# EAGLE schematic zeeSoC_mp3_Shield_v1.0 (EAGLE 6.5.0)

## Sheet 1 of 2
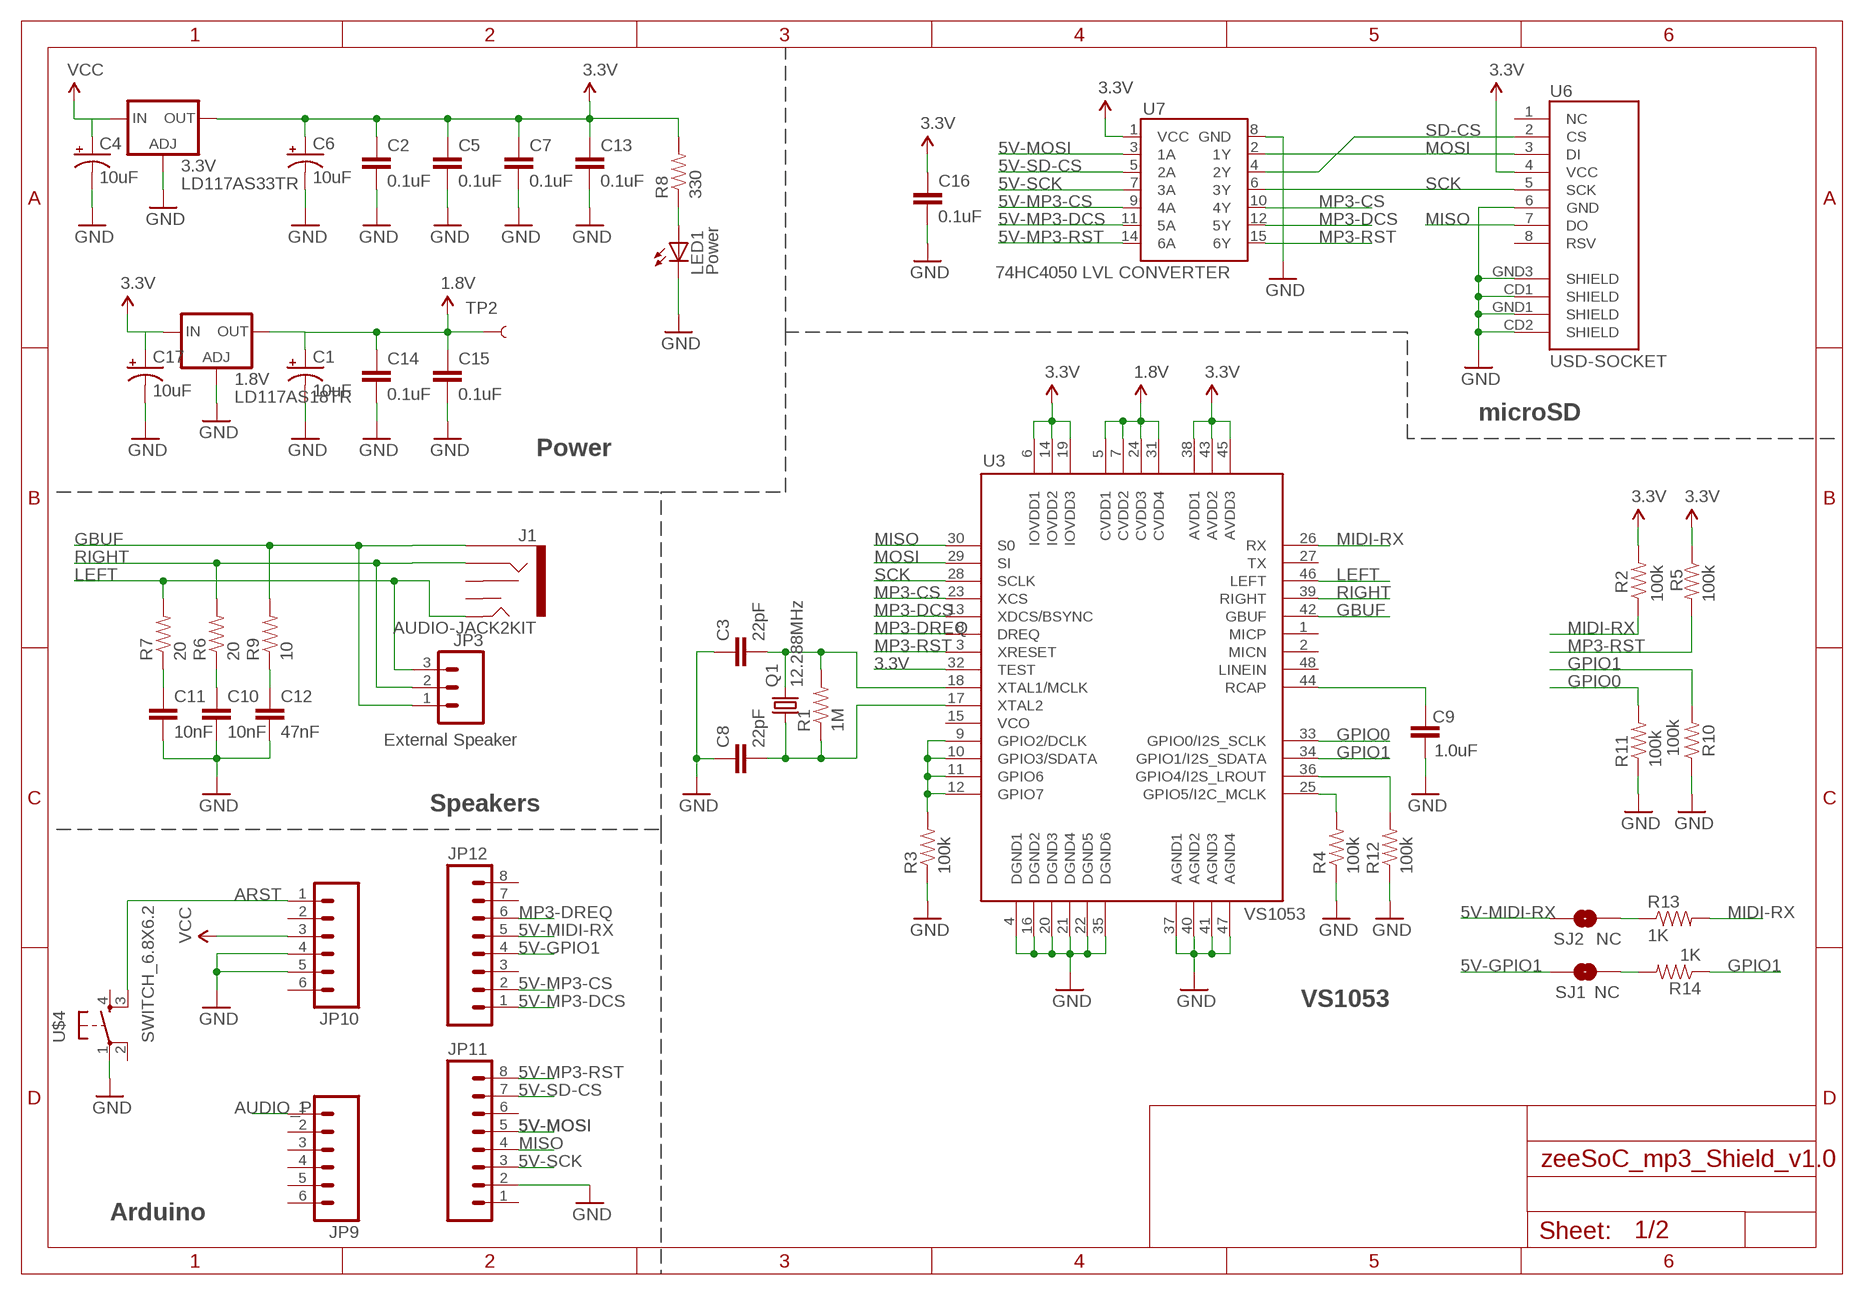
[diagram p0: schematic, sheet 1]

### Parts
1.8V  LD117AS18TR  [SOT223]
3.3V  LD117AS33TR  [SOT223]
C1  10uF  CAP_POL1206  [EIA3216]
C2  0.1uF  CAP0603-CAP  [0603-CAP]
C3  22pF  CAP0603-CAP  [0603-CAP]
C4  10uF  CAP_POL1206  [EIA3216]
C5  0.1uF  CAP0603-CAP  [0603-CAP]
C6  10uF  CAP_POL1206  [EIA3216]
C7  0.1uF  CAP0603-CAP  [0603-CAP]
C8  22pF  CAP0603-CAP  [0603-CAP]
C9  1.0uF  CAP0603-CAP  [0603-CAP]
C10  10nF  CAP0603-CAP  [0603-CAP]
C11  10nF  CAP0603-CAP  [0603-CAP]
C12  47nF  CAP0603-CAP  [0603-CAP]
C13  0.1uF  CAP0603-CAP  [0603-CAP]
C14  0.1uF  CAP0603-CAP  [0603-CAP]
C15  0.1uF  CAP0603-CAP  [0603-CAP]
C16  0.1uF  CAP0603-CAP  [0603-CAP]
C17  10uF  CAP_POL1206  [EIA3216]
J1  AUDIO-JACK2KIT  [AUDIO-JACK-KIT]
JP3  External Speaker  M03PTH  [1X03]
JP9  M06SILK_FEMALE_PTH  [1X06]
JP10  M06SILK_FEMALE_PTH  [1X06]
JP11  M08SILK_FEMALE_PTH  [1X08]
JP12  M08SILK_FEMALE_PTH  [1X08]
LED1  Power  LED0603  [LED-0603]
Q1  12.288MHz  CRYSTALHC49US  [HC49US]
R1  1M  RESISTOR0603-RES  [0603-RES]
R2  100k  RESISTOR0603-RES  [0603-RES]
R3  100k  RESISTOR0603-RES  [0603-RES]
R4  100k  RESISTOR0603-RES  [0603-RES]
R5  100k  RESISTOR0603-RES  [0603-RES]
R6  20  RESISTOR0603-RES  [0603-RES]
R7  20  RESISTOR0603-RES  [0603-RES]
R8  330  RESISTOR0603-RES  [0603-RES]
R9  10  RESISTOR0603-RES  [0603-RES]
R10  100k  RESISTOR0603-RES  [0603-RES]
R11  100k  RESISTOR0603-RES  [0603-RES]
R12  100k  RESISTOR0603-RES  [0603-RES]
R13  1K  RESISTOR0603-RES  [0603-RES]
R14  1K  RESISTOR0603-RES  [0603-RES]
SJ1  NC  JUMPER-PAD-2-NOYES_SILK  [PAD-JUMPER-2-NO_YES_SILK]
SJ2  NC  JUMPER-PAD-2-NOYES_SILK  [PAD-JUMPER-2-NO_YES_SILK]
TP2  TEST-POINT3X5  [PAD.03X.05]
U3  VS1053  VS1033  [LQFP-48]
U6  USD-SOCKET  USD-SOCKETNEW  [MICRO-SD-SOCKET-PP]
U7  74HC4050 LVL CONVERTER  HEX_CONVERTER  [SO016]
U$4  SWITCH_6.8X6.2  [SWITCH_6.8X6.2]

### Nets
1.8V: 1.8V.4(OUT) C1.A(+) C14.1 C15.1 TP2.P$1 U3.5(CVDD1) U3.7(CVDD2) U3.24(CVDD3) U3.31(CVDD4)
3.3V: 1.8V.3(IN) 3.3V.4(OUT) C2.1 C5.1 C6.A(+) C7.1 C13.1 C16.1 C17.A(+) R2.2 R5.1 R8.2 U3.6(IOVDD1) U3.14(IOVDD2) U3.19(IOVDD3) U3.32(TEST) U3.38(AVDD1) U3.43(AVDD2) U3.45(AVDD3) U6.4(VCC) U7.1(VCC) ; also sheet 2
5V-GPIO1: JP12.4 SJ1.2
5V-MIDI-RX: JP12.5 SJ2.1
5V-MOSI: JP11.5 U7.3(1A)
5V-MP3-CS: JP12.2 U7.9(4A)
5V-MP3-DCS: JP12.1 U7.11(5A)
5V-MP3-RST: JP11.8 U7.14(6A)
5V-SCK: JP11.3 U7.7(3A)
5V-SD-CS: JP11.7 U7.5(2A)
ARST: JP10.1 U$4.3
AUDIO_P: JP9.1
G1: R3.2 U3.9(GPIO2/DCLK) U3.10(GPIO3/SDATA) U3.11(GPIO6) U3.12(GPIO7)
G2: R4.2 U3.25(GPIO5/I2C_MCLK)
GBUF: J1.SLEEVE JP3.1 R9.2 U3.42(GBUF)
GND: 1.8V.1(ADJ) 3.3V.1(ADJ) C1.C(-) C2.2 C3.1 C4.C(-) C5.2 C6.C(-) C7.2 C8.1 C9.1 C10.2 C11.2 C12.2 C13.2 C14.2 C15.2 C16.2 C17.C(-) JP10.4 JP10.5 JP11.2 LED1.C R3.1 R4.1 R10.1 R11.1 R12.1 U3.4(DGND1) U3.16(DGND2) U3.20(DGND3) U3.21(DGND4) U3.22(DGND5) U3.35(DGND6) U3.37(AGND1) U3.40(AGND2) U3.41(AGND3) U3.47(AGND4) U6.6(GND) U6.CD1(SHIELD) U6.CD2(SHIELD) U6.GND1(SHIELD) U6.GND3(SHIELD) U7.8(GND) U$4.1 ; also sheet 2
GPIO0: R11.2 U3.33(GPIO0/I2S_SCLK)
GPIO1: R10.2 R14.1 U3.34(GPIO1/I2S_SDATA)
LEFT: J1.TIP JP3.3 R7.2 U3.46(LEFT) ; also sheet 2
MIDI-RX: R2.1 R13.2 U3.26(RX)
MISO: JP11.4 U3.30(S0) U6.7(DO)
MOSI: U3.29(SI) U6.3(DI) U7.2(1Y)
MP3-CS: U3.23(XCS) U7.10(4Y)
MP3-DCS: U3.13(XDCS/BSYNC) U7.12(5Y)
MP3-DREQ: JP12.6 U3.8(DREQ)
MP3-RST: R5.2 U3.3(XRESET) U7.15(6Y)
N$1: C9.2 U3.44(RCAP)
N$2: C12.1 R9.1
N$3: C10.1 R6.1
N$4: R14.2 SJ1.1
N$5: C11.1 R7.1
N$6: LED1.A R8.1
N$8: R13.1 SJ2.2
N$9: C3.2 Q1.2 R1.2 U3.18(XTAL1/MCLK)
N$10: C8.2 Q1.1 R1.1 U3.17(XTAL2)
N$73: R12.2 U3.36(GPIO4/I2S_LROUT)
RIGHT: J1.RING JP3.2 R6.2 U3.39(RIGHT) ; also sheet 2
SCK: U3.28(SCLK) U6.5(SCK) U7.6(3Y)
SD-CS: U6.2(CS) U7.4(2Y)
VCC: 3.3V.3(IN) C4.A(+) JP10.3 ; also sheet 2
Unconnected: J1.RSH J1.TSH JP9.2 JP9.3 JP9.4 JP9.5 JP9.6 JP10.2 JP10.6 JP11.1 JP11.6 JP12.3 JP12.7 JP12.8 U3.1(MICP) U3.2(MICN) U3.15(VCO) U3.27(TX) U3.48(LINEIN) U6.1(NC) U6.8(RSV) U$4.2 U$4.4

### Notes on the sheet
- microSD
- Power
- Speakers
- VS1053
- Arduino

## Sheet 2 of 2
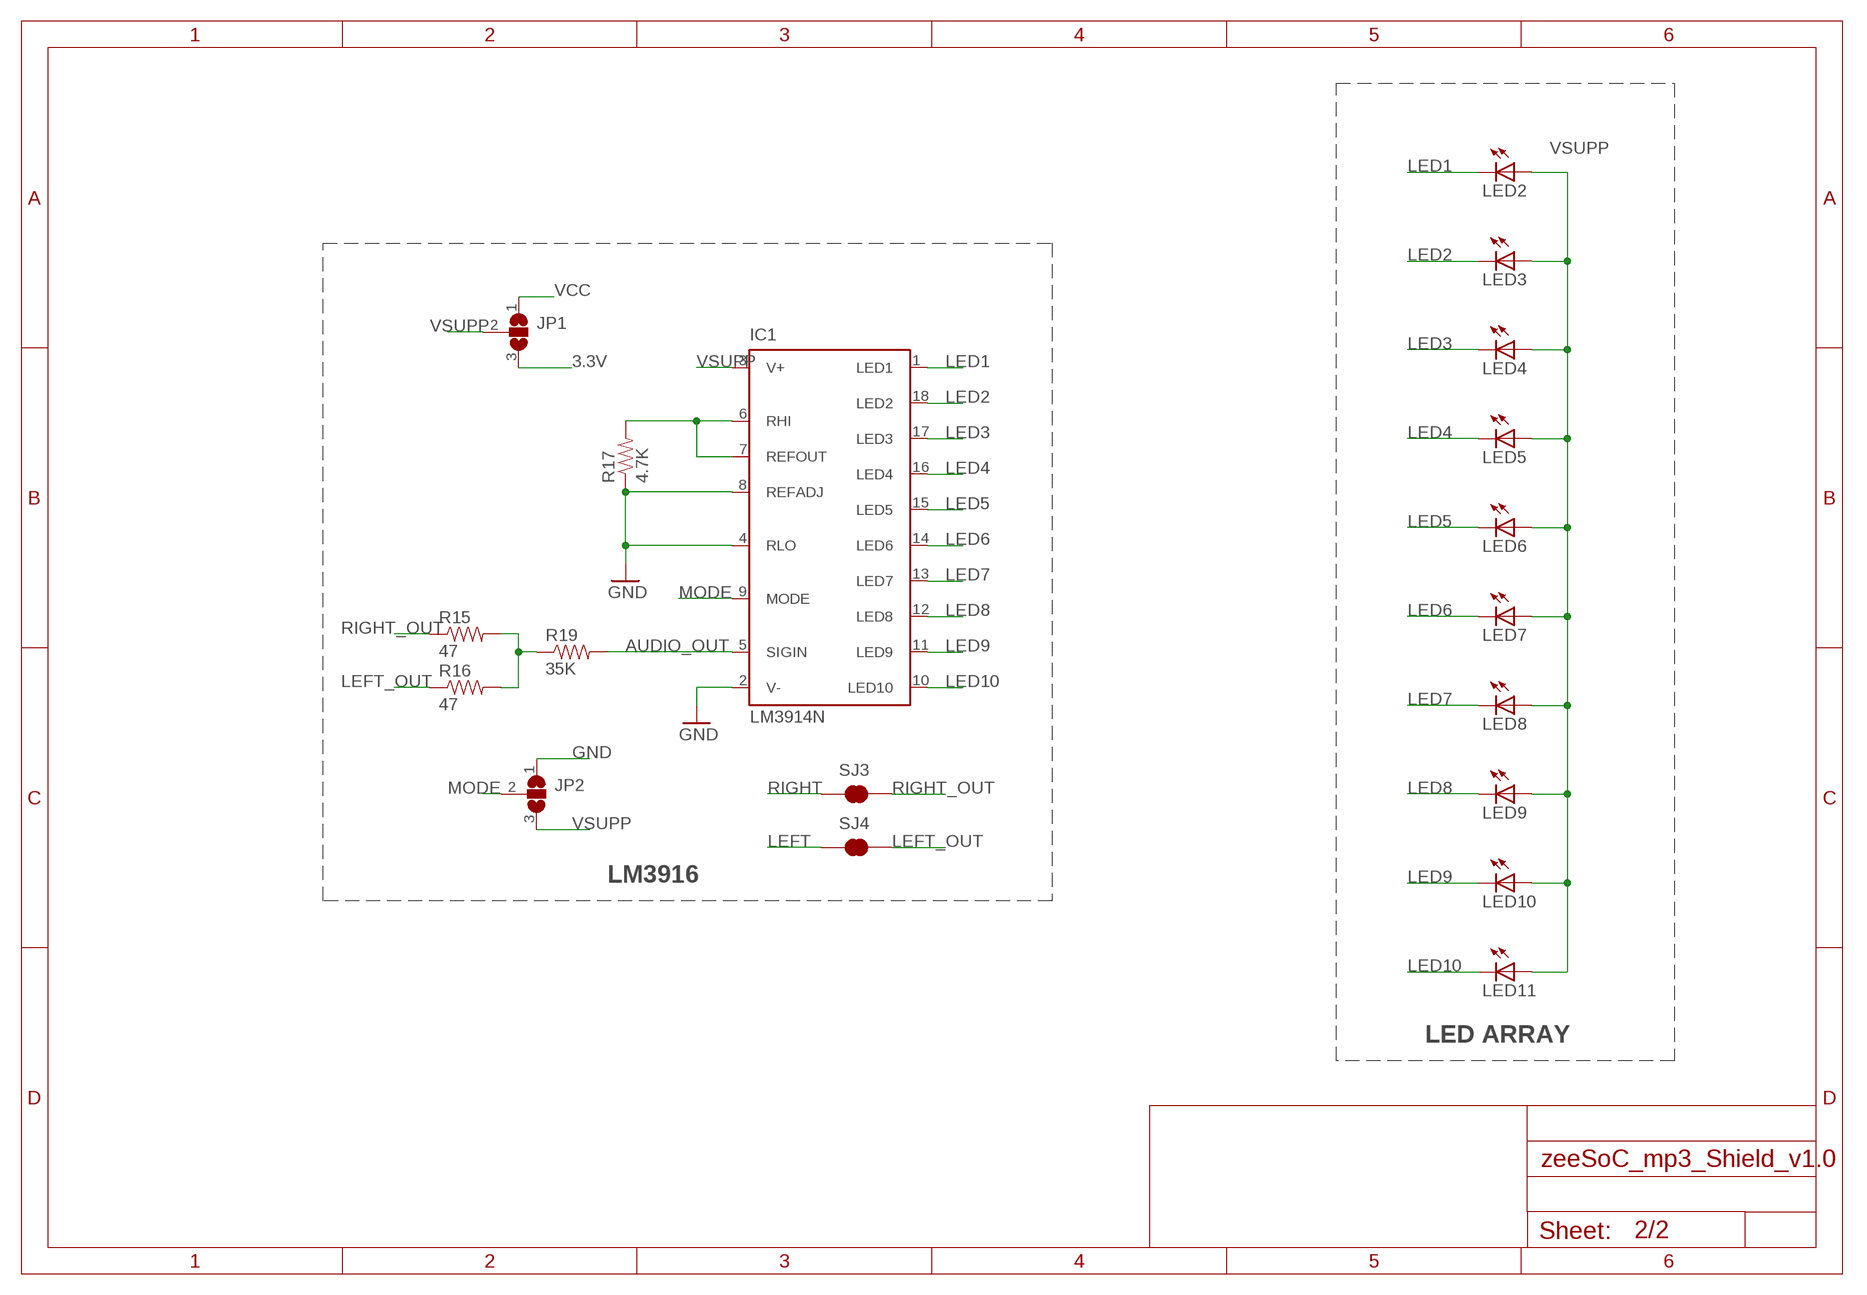
[diagram p1: schematic, sheet 2]

### Parts
IC1  LM3914N  [DIL18]
JP1  SJ2W  [SJ_2]
JP2  SJ2W  [SJ_2]
LED2  LEDCHIPLED_0603  [CHIPLED_0603]
LED3  LEDCHIPLED_0603  [CHIPLED_0603]
LED4  LEDCHIPLED_0603  [CHIPLED_0603]
LED5  LEDCHIPLED_0603  [CHIPLED_0603]
LED6  LEDCHIPLED_0603  [CHIPLED_0603]
LED7  LEDCHIPLED_0603  [CHIPLED_0603]
LED8  LEDCHIPLED_0603  [CHIPLED_0603]
LED9  LEDCHIPLED_0603  [CHIPLED_0603]
LED10  LEDCHIPLED_0603  [CHIPLED_0603]
LED11  LEDCHIPLED_0603  [CHIPLED_0603]
R15  47  RESISTOR0603-RES  [0603-RES]
R16  47  RESISTOR0603-RES  [0603-RES]
R17  4.7K  RESISTOR0603-RES  [0603-RES]
R19  35K  RESISTOR0603-RES  [0603-RES]
SJ3  JUMPER-PAD-2-NC_BY_TRACE  [PAD-JUMPER-2-NC_BY_TRACE_YES_SILK]
SJ4  JUMPER-PAD-2-NC_BY_TRACE  [PAD-JUMPER-2-NC_BY_TRACE_YES_SILK]

### Nets
3.3V: JP1.1 ; also sheet 1
AUDIO_OUT: IC1.5(SIGIN) R19.2
GND: IC1.2(V-) IC1.4(RLO) IC1.8(REFADJ) JP2.1 R17.1 ; also sheet 1
LED1: IC1.1(LED1) LED2.C
LED2: IC1.18(LED2) LED3.C
LED3: IC1.17(LED3) LED4.C
LED4: IC1.16(LED4) LED5.C
LED5: IC1.15(LED5) LED6.C
LED6: IC1.14(LED6) LED7.C
LED7: IC1.13(LED7) LED8.C
LED8: IC1.12(LED8) LED9.C
LED9: IC1.11(LED9) LED10.C
LED10: IC1.10(LED10) LED11.C
LEFT: SJ4.1 ; also sheet 1
LEFT_OUT: R16.1 SJ4.2
MODE: IC1.9(MODE) JP2.2
N$20: IC1.6(RHI) IC1.7(REFOUT) R17.2
N$22: R15.2 R16.2 R19.1
RIGHT: SJ3.1 ; also sheet 1
RIGHT_OUT: R15.1 SJ3.2
VCC: JP1.3 ; also sheet 1
VSUPP: IC1.3(V+) JP1.2 JP2.3 LED2.A LED3.A LED4.A LED5.A LED6.A LED7.A LED8.A LED9.A LED10.A LED11.A

### Notes on the sheet
- LM3916
- LED ARRAY

## Library data of the parts
1.8V 3.3V = v-reg:LD117A?*: Low drop fixed and adjustable positive voltage regulators 1 A Source: http://www.st.com/stonline/products/literature/ds/7194/ld1117axx.pdf
C1 C4 C6 C17 = SparkFun:CAP_POL: Capacitor Polarized These are standard SMD and PTH capacitors. Normally 10uF, 47uF, and 100uF in electrolytic and tantalum varieties. Always verify the external diameter of the through hole cap, it varies with capacity, voltage, and manufacturer. The EIA devices should be standard.
C2 C3 C5 C7-C16 = SparkFun-Capacitors:CAP: Capacitor Standard 0603 ceramic capacitor, and 0.1" leaded capacitor.
IC1 = national-semiconductor:LM391: Dot/Bar Display Driver Source: Data sheet LM3915 <http://www.national.com/ds/LM/LM3915.pdf> Data sheet LM3914 <http://www.national.com/ds/LM/LM3914.pdf>
J1 = SparkFun-Connectors:AUDIO-JACK2: Stereo audio jack with bypass switches. SMT version used on LilyPad MP3 board.; PROD_ID: CONN-08774
JP1 JP2 = jumper:SJ2W: SMD solder JUMPER
JP3 = SparkFun:M03: Header 3 Standard 3-pin 0.1" header. Use with straight break away headers (SKU : PRT-00116), right angle break away headers (PRT-00553), swiss pins (PRT-00743), machine pins (PRT-00117), and female headers (PRT-00115). Molex polarized connector foot print use with SKU : PRT-08232 with associated crimp pins and housings.
JP9 JP10 = SparkFun-Connectors:M06: Header 6 Standard 6-pin 0.1" header. Use with straight break away headers (SKU : PRT-00116), right angle break away headers (PRT-00553), swiss pins (PRT-00743), machine pins (PRT-00117), and female headers (PRT-00115). Molex polarized connector foot print use with SKU : PRT-08094 with associated crimp pins and housings. NOTES ON THE VARIANTS LOCK and LOCK_LONGPADS... This footprint was designed to help hold the alignment of a through-hole component (i.e. 6-pin header) while soldering it into place. You may notice that each hole has been shifted either up or down by 0.005 of an inch from it's more standard position (which is a perfectly straight line). This slight alteration caused the pins (the squares in the middle) to touch the edges of the holes. Because they are alternating, it causes a "brace" to hold the component in place. 0.005 has proven to be the perfect amount of "off-center" position when using our standard breakaway headers. Although looks a little odd when you look at the bare footprint, once you have a header in there, the alteration is very hard to notice. Also,if you push a header all the way into place, it is covered up entirely on the bottom side. This idea of altering the position of holes to aid alignment will be further integrated into the Sparkfun Library for other footprints. It can help hold any component with 3 or more connection pins.; PROD_ID: CONN-08437
JP11 JP12 = SparkFun-Connectors:M08: Header 8 Standard 8-pin 0.1" header. Use with straight break away headers (SKU : PRT-00116), right angle break away headers (PRT-00553), swiss pins (PRT-00743), machine pins (PRT-00117), and female headers (PRT-00115).; PROD_ID: CONN-08438
LED1 = SparkFun:LED: LEDs Standard schematic elements and footprints for 5mm, 3mm, 1206, and 0603 sized LEDs. 5mm - Spark Fun Electronics SKU : COM-00529 (and others)
LED2-LED11 = led:LED: LED OSRAM: - CHIPLED LG R971, LG N971, LY N971, LG Q971, LY Q971, LO R971, LY R971 LH N974, LH R974 LS Q976, LO Q976, LY Q976 LO Q996 - Hyper CHIPLED LW Q18S LB Q993, LB Q99A, LB R99A - SideLED LS A670, LO A670, LY A670, LG A670, LP A670 LB A673, LV A673, LT A673, LW A673 LH A674 LY A675 LS A676, LA A676, LO A676, LY A676, LW A676 LS A679, LY A679, LG A679 - Hyper Micro SIDELED® LS Y876, LA Y876, LO Y876, LY Y876 LT Y87S - SmartLED LW L88C, LW L88S LB L89C, LB L89S, LG L890 LS L89K, LO L89K, LY L89K LS L896, LA L896, LO L896, LY L896 - TOPLED LS T670, LO T670, LY T670, LG T670, LP T670 LSG T670, LSP T670, LSY T670, LOP T670, LYG T670 LG T671, LOG T671, LSG T671 LB T673, LV T673, LT T673, LW T673 LH T674 LS T676, LA T676, LO T676, LY T676, LB T676, LH T676, LSB T676, LW T676 LB T67C, LV T67C, LT T67C, LS T67K, LO T67K, LY T67K, LW E67C LS E67B, LA E67B, LO E67B, LY E67B, LB E67C, LV E67C, LT E67C LW T67C LS T679, LY T679, LG T679 LS T770, LO T770, LY T770, LG T770, LP T770 LB T773, LV T773, LT T773, LW T773 LH T774 LS E675, LA E675, LY E675, LS T675 LS T776, LA T776, LO T776, LY T776, LB T776 LHGB T686 LT T68C, LB T68C - Hyper Mini TOPLED® LB M676 - Mini TOPLED Santana® LG M470 LS M47K, LO M47K, LY M47K Source: http://www.osram.convergy.de LUXEON: - LUMILED® LXK2-PW12-R00, LXK2-PW12-S00, LXK2-PW14-U00, LXK2-PW14-V00 LXK2-PM12-R00, LXK2-PM12-S00, LXK2-PM14-U00 LXK2-PE12-Q00, LXK2-PE12-R00, LXK2-PE12-S00, LXK2-PE14-T00, LXK2-PE14-U00 LXK2-PB12-K00, LXK2-PB12-L00, LXK2-PB12-M00, LXK2-PB14-N00, LXK2-PB14-P00, LXK2-PB14-Q00 LXK2-PR12-L00, LXK2-PR12-M00, LXK2-PR14-Q00, LXK2-PR14-R00 LXK2-PD12-Q00, LXK2-PD12-R00, LXK2-PD12-S00 LXK2-PH12-R00, LXK2-PH12-S00 LXK2-PL12-P00, LXK2-PL12-Q00, LXK2-PL12-R00 Source: www.luxeon.com KINGBRIGHT: KA-3528ASYC Source: www.kingbright.com
Q1 = SparkFun-FreqCtrl:CRYSTAL: Various standard crystals. Proven footprints.
R1-R9 R12-R17 R19 = SparkFun-Resistors:RESISTOR: Resistor Basic schematic elements and footprints for 0603, 1206, and PTH resistors.
R10 R11 = SparkFun:RESISTOR: Resistor Basic schematic elements and footprints for 0603, 1206, and PTH resistors.
SJ1 SJ2 = SparkFun-Passives:JUMPER-PAD-2-NO
SJ3 SJ4 = SparkFun-Passives:JUMPER-PAD-2-NC_BY_TRACE
TP2 = SparkFun:TEST-POINT
U3 = SparkFun:VS1033
U6 = SparkFun:USD-SOCKET: microSD Socket Push-push type uSD socket. Schematic element and footprint production proven. Spark Fun Electronics SKU : PRT-00127. tDoc lines correctly indicate media card edge positions when inserting (unlocked, locked, depressed).
U7 = SparkFun:HEX_CONVERTER
U$4 = Frenoy_Custom:SWITCH_6.8X6.2